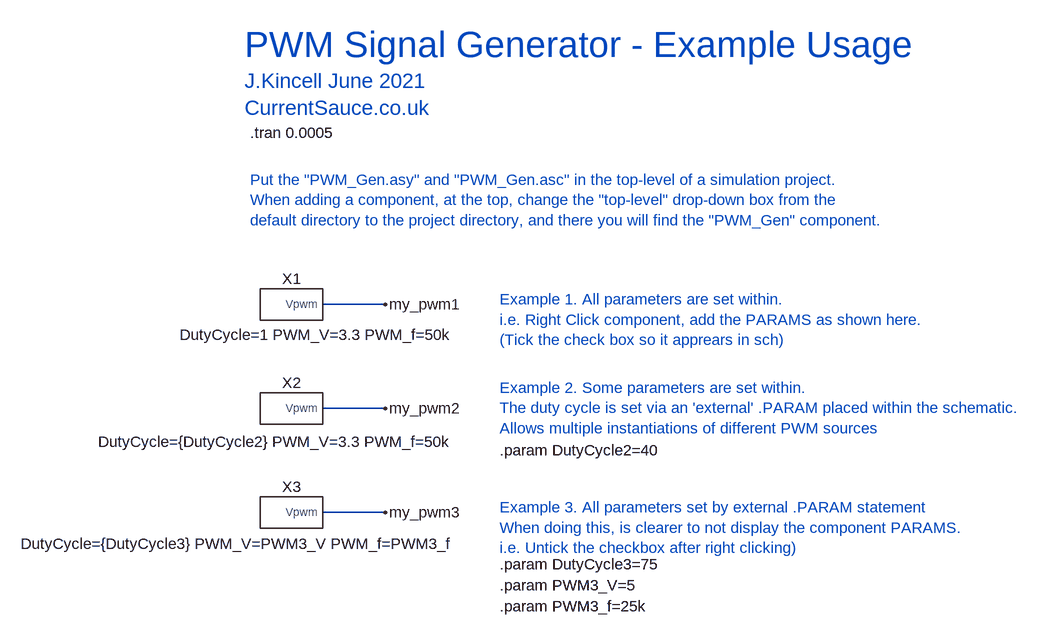
[diagram p0: schematic PWM_example_usage.asc]
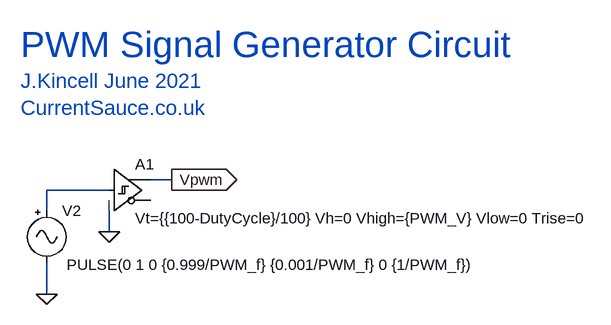
[diagram p1: sub-circuit pwm_gen.asc]
PWM_example_usage.asc, the LTspice schematic file:
Version 4
SHEET 1 880 680
WIRE -320 -64 -416 -64
WIRE -320 96 -416 96
WIRE -320 256 -416 256
FLAG -320 -64 my_pwm1
FLAG -320 96 my_pwm2
FLAG -320 256 my_pwm3
SYMBOL PWM_Gen -464 -64 R0
WINDOW 39 37 62 Bottom 2
SYMATTR SpiceLine DutyCycle=1 PWM_V=3.3 PWM_f=50k
SYMATTR InstName X1
SYMBOL PWM_Gen -464 96 R0
WINDOW 39 -25 67 Bottom 2
SYMATTR SpiceLine DutyCycle={DutyCycle2} PWM_V=3.3 PWM_f=50k
SYMATTR InstName X2
SYMBOL PWM_Gen -464 256 R0
WINDOW 39 -84 64 Bottom 2
SYMATTR SpiceLine DutyCycle={DutyCycle3} PWM_V=PWM3_V PWM_f=PWM3_f
SYMATTR InstName X3
TEXT -528 -328 Left 2 !.tran 0.0005
TEXT -144 160 Left 2 !.param DutyCycle2=40
TEXT -144 336 Left 2 !.param DutyCycle3=75
TEXT -536 -464 Left 5 ;PWM Signal Generator - Example Usage
TEXT -536 -408 Left 3 ;J.Kincell June 2021\nCurrentSauce.co.uk
TEXT -144 -72 Left 2 ;Example 1. All parameters are set within.\ni.e. Right Click component, add the PARAMS as shown here.\n(Tick the check box so it apprears in sch)
TEXT -144 64 Left 2 ;Example 2. Some parameters are set within.\nThe duty cycle is set via an 'external' .PARAM placed within the schematic.\nAllows multiple instantiations of different PWM sources
TEXT -144 368 Left 2 !.param PWM3_V=5
TEXT -144 400 Left 2 !.param PWM3_f=25k
TEXT -144 248 Left 2 ;Example 3. All parameters set by external .PARAM statement\nWhen doing this, is clearer to not display the component PARAMS.\ni.e. Untick the checkbox after right clicking)
TEXT -528 -256 Left 2 ;Put the "PWM_Gen.asy" and "PWM_Gen.asc" in the top-level of a simulation project.\nWhen adding a component, at the top, change the "top-level" drop-down box from the\ndefault directory to the project directory, and there you will find the "PWM_Gen" component.

pwm_gen.asc, the sub-circuit schematic file:
Version 4
SHEET 1 880 680
WIRE -1296 64 -1328 64
WIRE -1392 80 -1488 80
WIRE -1488 112 -1488 80
WIRE -1392 144 -1392 112
WIRE -1488 240 -1488 192
FLAG -1488 240 0
FLAG -1296 64 Vpwm
IOPIN -1296 64 Out
FLAG -1392 144 0
SYMBOL Misc\\signal -1488 96 R0
WINDOW 123 0 0 Left 0
WINDOW 39 0 0 Left 0
WINDOW 3 31 99 Left 2
SYMATTR Value PULSE(0 1 0 {0.999/PWM_f} {0.001/PWM_f} 0 {1/PWM_f})
SYMATTR InstName V2
SYMBOL Digital\\schmitt -1392 16 R0
WINDOW 3 40 107 Left 2
SYMATTR Value Vt={{100-DutyCycle}/100} Vh=0 Vhigh={PWM_V} Vlow=0 Trise=0
SYMATTR InstName A1
TEXT -1528 -144 Left 5 ;PWM Signal Generator Circuit
TEXT -1528 -88 Left 3 ;J.Kincell June 2021\nCurrentSauce.co.uk

The netlist it stands for:
* PWM_example_usage.asc
XX1 my_pwm1 pwm_gen params: DutyCycle=1 PWM_V=3.3 PWM_f=50k
XX2 my_pwm2 pwm_gen params: DutyCycle={DutyCycle2} PWM_V=3.3 PWM_f=50k
XX3 my_pwm3 pwm_gen params: DutyCycle={DutyCycle3} PWM_V=PWM3_V PWM_f=PWM3_f

* block symbol definitions
.subckt pwm_gen Vpwm
V2 N001 0 PULSE(0 1 0 {0.999/PWM_f} {0.001/PWM_f} 0 {1/PWM_f})
A1 N001 0 0 0 0 0 Vpwm 0 SCHMITT Vt={{100-DutyCycle}/100} Vh=0 Vhigh={PWM_V} Vlow=0 Trise=0
* PWM Signal Generator Circuit
* J.Kincell June 2021
* CurrentSauce.co.uk
.ends pwm_gen

.tran 0.0005
.param DutyCycle2=40
.param DutyCycle3=75
* PWM Signal Generator - Example Usage
* J.Kincell June 2021
* CurrentSauce.co.uk
* Example 1. All parameters are set within.
* i.e. Right Click component, add the PARAMS as shown here.
* (Tick the check box so it apprears in sch)
* Example 2. Some parameters are set within.
* The duty cycle is set via an 'external' .PARAM placed within the schematic.
* Allows multiple instantiations of different PWM sources
.param PWM3_V=5
.param PWM3_f=25k
* Example 3. All parameters set by external .PARAM statement
* When doing this, is clearer to not display the component PARAMS.
* i.e. Untick the checkbox after right clicking)
* Put the "PWM_Gen.asy" and "PWM_Gen.asc" in the top-level of a simulation project.
* When adding a component, at the top, change the "top-level" drop-down box from the
* default directory to the project directory, and there you will find the "PWM_Gen" component.
.backanno
.end